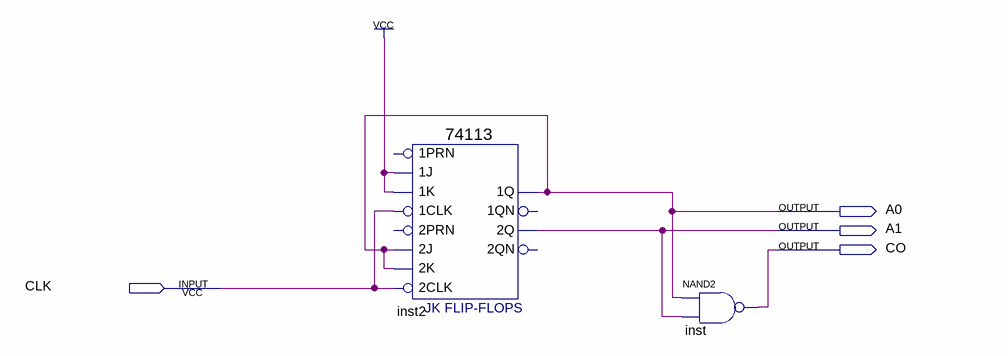
[diagram p0: schematic sheet]
// Quartus schematic 4counter.bdf as structural Verilog: 2 symbols, 4 pins
module \4counter  (
  input  CLK,
  output A0,
  output A1,
  output CO
);

  \74113  inst2 (
    .\1J (1'b1), .\1K (1'b1), .\1CLK (CLK), .\2J (A0), .\2K (A0), .\2CLK (CLK), .\1Q (A0), .\2Q (A1));  // open: 1PRN, 2PRN, 1QN, 2QN
  nand inst (CO, A0, A1);
endmodule
